# Altium schematic sheet STM-main.SchDoc
size 292 x 193 mm; Opracowal: Mieszko Mazurkiewicz; projRevision: KD; Author: Mieszko Mazurkiewicz; CompanyName: Politechnika Warszawska; Organization: EITI; Address1: Nowowiejska 15/19; Address2: 00-665 Warszawa; Revision: KD; SheetNumber: 2; SheetTotal: 8; HTTPLink: www.pw.edu.pl
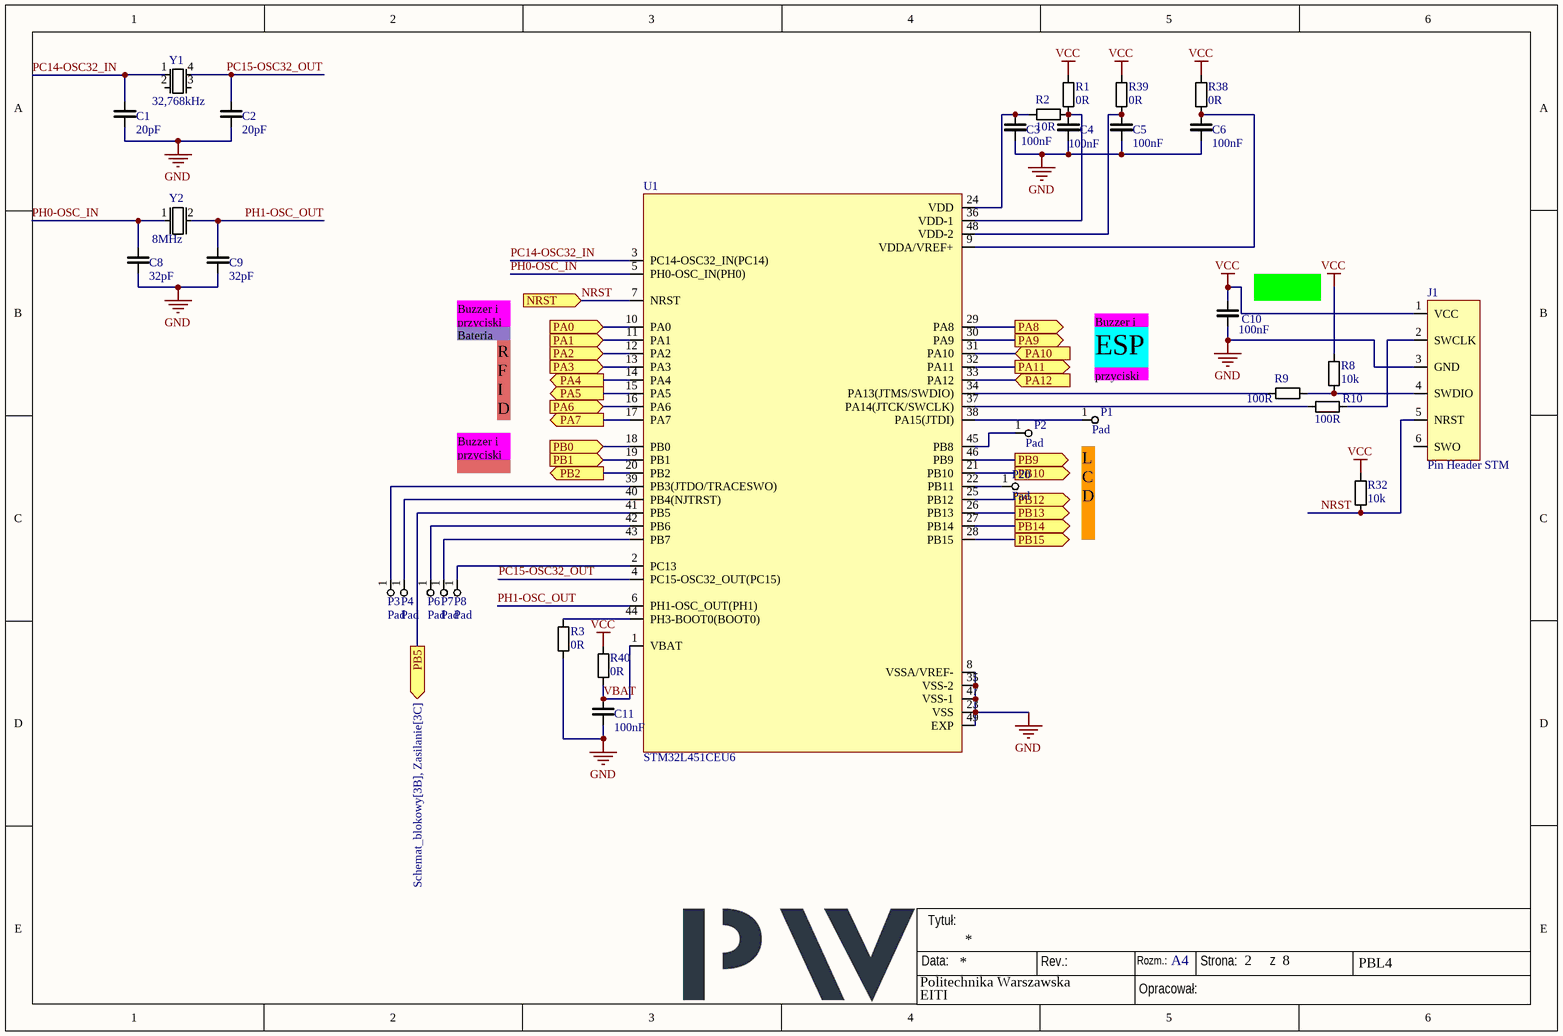
[diagram p0: STM-main.SchDoc]

## Parts
C1  20pF  [0603_CAP]
C2  20pF  [0603_CAP]
C3  100nF  [0603_CAP]
C4  100nF  [0603_CAP]
C5  100nF  [0603_CAP]
C6  100nF  [0603_CAP]
C8  32pF  [0603_CAP]
C9  32pF  [0603_CAP]
C10  100nF  [0603_CAP]
C11  100nF  [0603_CAP]
J1  Pin Header STM  [SAMTEC_TSW-112-16-T-S-06]
P1  Pad  [pad]  (no BOM)
P2  Pad  [pad]  (no BOM)
P3  Pad  [pad]  (no BOM)
P4  Pad  [pad]  (no BOM)
P6  Pad  [pad]  (no BOM)
P7  Pad  [pad]  (no BOM)
P8  Pad  [pad]  (no BOM)
P20  Pad  [pad]  (no BOM)
R1  0R  [0603_RES]
R2  10R  [0603_RES]
R3  0R  [0603_RES]
R8  10k  [0603_RES]
R9  100R  [0603_RES]
R10  100R  [0603_RES]
R32  10k  [0603_RES]
R38  0R  [0603_RES]
R39  0R  [0603_RES]
R40  0R  [0603_RES]
U1  STM32L451CEU6  [QFN50P700X700X60-49N]
Y1  32,768kHz  [Q 0,032768-SMQ32SL-12,5-20-T1-LF]
Y2  8MHz  [ATS080BSM-1E]

## Ports
NRST (in, see Schemat_blokowy[3C]), PA0 (in, see Schemat_blokowy[3C]), PA1 (in, see Schemat_blokowy[3B], Zasilanie[3B]), PA2 (in, see Schemat_blokowy[3D]), PA3 (in, see Schemat_blokowy[3D]), PA4 (out, see Schemat_blokowy[4D]), PA5 (out, see Schemat_blokowy[4D]), PA6 (in, see Schemat_blokowy[3D]), PA7 (out, see Schemat_blokowy[4D]), PA8 (out, see Schemat_blokowy[3C], Buzzer[2C]), PA9 (out, see Schemat_blokowy[4B]), PA10 (in, see Schemat_blokowy[4B]), PA11 (out, see Schemat_blokowy[4B]), PA12 (in, see Schemat_blokowy[3C]), PB0 (in, see Schemat_blokowy[3C]), PB1 (in, see Schemat_blokowy[3C]), PB2 (out, see Schemat_blokowy[4D]), PB5 (out, see Schemat_blokowy[3B], Zasilanie[3C]), PB9 (out, see Schemat_blokowy[4C]), PB10 (out, see Schemat_blokowy[4C]), PB12 (out, see Schemat_blokowy[4C]), PB13 (out, see Schemat_blokowy[4C]), PB14 (out, see Schemat_blokowy[4C]), PB15 (out, see Schemat_blokowy[4C])

## Nets
GND: C1.1 C2.1 C3.1 C4.1 C5.1 C6.1 C8.1 C9.1 C10.1 C11.1 J1.3(GND) R3.1 U1.8(VSSA/VREF-) U1.23(VSS) U1.35(VSS-2) U1.47(VSS-1) U1.49(EXP)
VCC: C10.2 J1.1(VCC) R1.2 R8.2 R32.2 R38.2 R39.2 R40.2
NRST: J1.5(NRST) R32.1 U1.7(NRST) ; port NRST
PA0: U1.10(PA0) ; port PA0
PA1: U1.11(PA1) ; port PA1
PA2: U1.12(PA2) ; port PA2
PA3: U1.13(PA3) ; port PA3
PA4: U1.14(PA4) ; port PA4
PA5: U1.15(PA5) ; port PA5
PA6: U1.16(PA6) ; port PA6
PA7: U1.17(PA7) ; port PA7
PA8: U1.29(PA8) ; port PA8
PA9: U1.30(PA9) ; port PA9
PA10: U1.31(PA10) ; port PA10
PA11: U1.32(PA11) ; port PA11
PA12: U1.33(PA12) ; port PA12
PB0: U1.18(PB0) ; port PB0
PB1: U1.19(PB1) ; port PB1
PB2: U1.20(PB2) ; port PB2
PB5: U1.41(PB5) ; port PB5
PB9: U1.46(PB9) ; port PB9
PB10: U1.21(PB10) ; port PB10
PB12: U1.25(PB12) ; port PB12
PB13: U1.26(PB13) ; port PB13
PB14: U1.27(PB14) ; port PB14
PB15: U1.28(PB15) ; port PB15
PC14-OSC32_IN: C1.2 U1.3(PC14-OSC32_IN(PC14)) Y1.1
PC15-OSC32_OUT: C2.2 U1.4(PC15-OSC32_OUT(PC15)) Y1.4
PH0-OSC_IN: C8.2 U1.5(PH0-OSC_IN(PH0)) Y2.1
PH1-OSC_OUT: C9.2 U1.6(PH1-OSC_OUT(PH1)) Y2.2
VBAT: C11.2 R40.1 U1.1(VBAT)
NetC3_2: C3.2 R2.1 U1.24(VDD)
NetC4_2: C4.2 R1.1 R2.2 U1.36(VDD-1)
NetC5_2: C5.2 R39.1 U1.48(VDD-2)
NetC6_2: C6.2 R38.1 U1.9(VDDA/VREF+)
NetJ1_2: J1.2(SWCLK) R10.2
NetJ1_4: J1.4(SWDIO) R8.1 R9.2
NetP1_1: P1.1 U1.38(PA15(JTDI))
NetP2_1: P2.1 U1.45(PB8)
NetP3_1: P3.1 U1.39(PB3(JTDO/TRACESWO))
NetP4_1: P4.1 U1.40(PB4(NJTRST))
NetP6_1: P6.1 U1.42(PB6)
NetP7_1: P7.1 U1.43(PB7)
NetP8_1: P8.1 U1.2(PC13)
NetP20_1: P20.1 U1.22(PB11)
NetR3_2: R3.2 U1.44(PH3-BOOT0(BOOT0))
NetR9_1: R9.1 U1.34(PA13(JTMS/SWDIO))
NetR10_1: R10.1 U1.37(PA14(JTCK/SWCLK))

Not connected (* = marked no-connect by the designer): J1 6(SWO); Y1 2 3

## Notes on the sheet
- (near C10) SWD
- Buzzer i
  przyciski
- Bateria
- (near P1) Buzzer i
  przyciski
- ESP
- R
  F
  I
  D
- RFID
- (near P1) L
  C
  D
- Data:
- Tytuł:
- Rev.:
- Rozm.:
- A4
- Strona:
- z
- PBL4
- Opracował:

## Library data of the parts
C1-C6 C8-C11 = Cap: Ceramic capacitor
  C1 C2: Value: 20pF
  C3-C6 C10 C11: Value: 100nF
  C8 C9: Value: 32pF
R1-R3 R8-R10 R32 R38-R40 = RES: Resistor
  R1 R3 R38-R40: Value: 0R
  R2: Value: 10R
  R8 R32: Value: 10k
  R9 R10: Value: 100R
Y1 = Oscylator4: Oscilator; Value: 32,768kHz; PartNumber: Q 0,032768-SMQ32SL-12,5-20-T1-LF; Link: https://www.digikey.pl/en/products/detail/jauch-quartz/Q-0-032768-SMQ32SL-12-5-20-T1-LF/21286751?_gl=1%2A2eagbn%2A_up%2AMQ..%2A_gs%2AMQ..&gclid=Cj0KCQjwtJ6_BhDWARIsAGanmKdDq7PmRTSwRQOEO6Y2chDsJ8ztLHAI7vvkfzRwrFQTKCYtsUalh8YaArHxEALw_wcB&gclsrc=aw.ds&fbclid=IwZXh0bgNhZW0CMTEAAR5vhhD_Q673JviUlLJ614BYKrSfCtvcQBHdiJxk0akfVJH2lUWrq4RgPhm8Mw_aem_d1V_8h-L4hTcNT0FPwb2dg
Y2 = Oscylator: Oscilator; Value: 8MHz; PartNumber: ATS080BSM-1E; Link: https://www.digikey.pl/en/products/detail/cts-frequency-controls/ATS080BSM-1E/4308686?_gl=1%2Acv1dpn%2A_up%2AMQ..%2A_gs%2AMQ..&gclid=Cj0KCQjwtJ6_BhDWARIsAGanmKdDq7PmRTSwRQOEO6Y2chDsJ8ztLHAI7vvkfzRwrFQTKCYtsUalh8YaArHxEALw_wcB&gclsrc=aw.ds&fbclid=IwZXh0bgNhZW0CMTEAAR769WtCyuMDpBpLjQbkyGDyyz4UOol-R9__mkEURnvs7i-NTlbvwc0iaZLtNw_aem_AJwTIGPzL7xMi4E202jF3w
U1 = STM32L451CEU6: PartNumber: STM32L451CEU6